# Altium schematic sheet Acquisition-System_Headphones_V1.0.SchDoc: Acquisition-System
size A4; PageSetup: Record=PageOptions|CenterHorizontal=True|CenterVertical=True|PrintScale=0.97|XCorrection=1.00|YCorrection=1.00|PrintKind=0|BorderSize=5000000|LeftOffset=0|BottomOffset=0|Orientation=2|PaperLength=1000|PaperWidth=1000|Scale=100|PaperSource=7|PrintQuality=-3|MediaType=1|DitherType=10|PrintScaleMode=1|PaperKind=A4|PaperIndex=9; Organization: Ostschweizer Fachhochschule; Address2: Florian Baumgartner & Thierry Schwaller; Address3: florian.baumgartner@ost.ch; DocumentNumber: 3; Revision: V1.0; SheetNumber: 3; SheetTotal: 5; Author: Florian Baumgartner & Alain Keller; Subtitle: Headphones Output
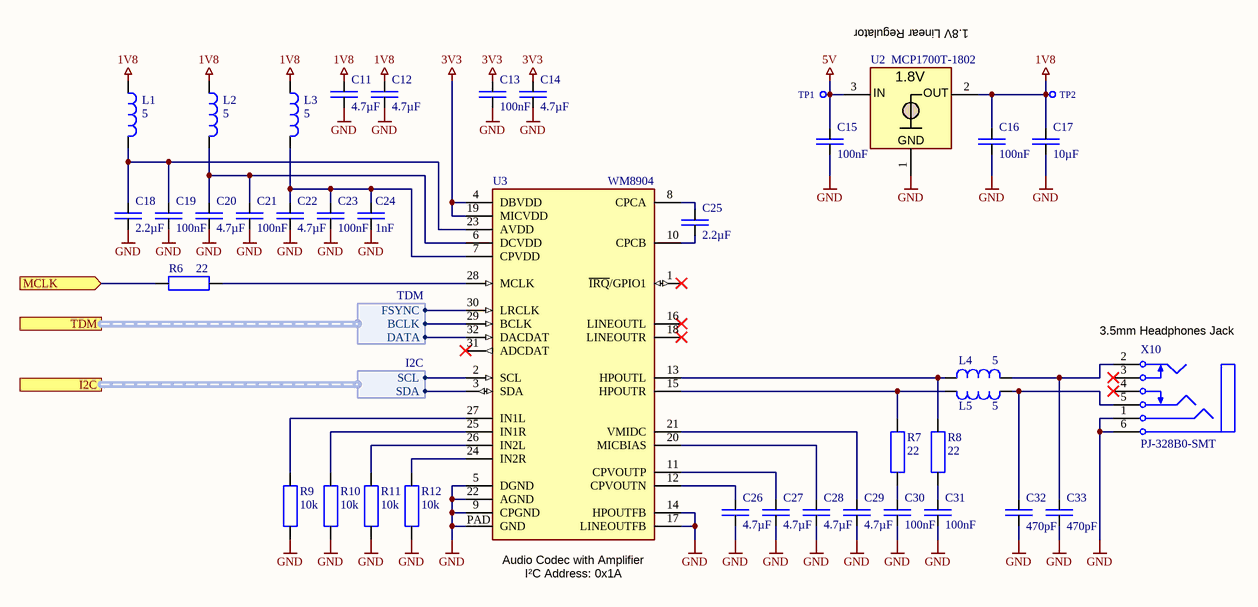
[diagram p0: Acquisition-System_Headphones_V1.0.SchDoc]

## Parts
C11  4.7µF  [SMD Keramikkondensator 0603]
C12  4.7µF  [SMD Keramikkondensator 0603]
C13  100nF  [SMD Keramikkondensator 0603]
C14  4.7µF  [SMD Keramikkondensator 0603]
C15  100nF  [SMD Keramikkondensator 0603]
C16  100nF  [SMD Keramikkondensator 0603]
C17  10µF  [SMD Keramikkondensator 1206]
C18  2.2µF  [SMD Keramikkondensator 0603]
C19  100nF  [SMD Keramikkondensator 0603]
C20  4.7µF  [SMD Keramikkondensator 0603]
C21  100nF  [SMD Keramikkondensator 0603]
C22  4.7µF  [SMD Keramikkondensator 0603]
C23  100nF  [SMD Keramikkondensator 0603]
C24  1nF  [SMD Keramikkondensator 0603]
C25  2.2µF  [SMD Keramikkondensator 0603]
C26  4.7µF  [SMD Keramikkondensator 0603]
C27  4.7µF  [SMD Keramikkondensator 0603]
C28  4.7µF  [SMD Keramikkondensator 0603]
C29  4.7µF  [SMD Keramikkondensator 0603]
C30  100nF  [SMD Keramikkondensator 0603]
C31  100nF  [SMD Keramikkondensator 0603]
C32  470pF  [SMD Keramikkondensator 0603]
C33  470pF  [SMD Keramikkondensator 0603]
L1  5  [SMD Ferritbead 0805]
L2  5  [SMD Ferritbead 0805]
L3  5  [SMD Ferritbead 0805]
L4  5  [SMD Ferritbead 0805]
L5  5  [SMD Ferritbead 0805]
R6  22  [SMD Widerstand 0603]
R7  22  [SMD Widerstand 0603]
R8  22  [SMD Widerstand 0603]
R9  10k  [SMD Widerstand 0603]
R10  10k  [SMD Widerstand 0603]
R11  10k  [SMD Widerstand 0603]
R12  10k  [SMD Widerstand 0603]
TP1  X-TP  [SMD Testpunkt Ø1mm]  (value not drawn)  (no BOM)
TP2  X-TP  [SMD Testpunkt Ø1mm]  (value not drawn)  (no BOM)
U2  MCP1700T-1802  [SMD IC SOT-23]
U3  WM8904  [SMD IC TO-263-5]
X10  PJ-328B0-SMT  [SMD 3.5mm Jack (PJ-328B0-SMT)]

## Ports
I2C (harness I2C), MCLK (in), TDM (harness TDM)

## Harnesses
I2C: SCL, SDA
TDM: BCLK, FSYNC, DATA

## Nets
1V8: C11.2 C12.2 C16.2 C17.2 L1.1 L2.1 L3.1 TP2.1 U2.2(OUT)
3V3: C13.2 C14.2 U3.4(DBVDD) U3.19(MICVDD)
5V: C15.2 TP1.1 U2.3(IN)
GND: C11.1 C12.1 C13.1 C14.1 C15.1 C16.1 C17.1 C18.1 C19.1 C20.1 C21.1 C22.1 C23.1 C24.1 C26.1 C27.1 C28.1 C29.1 C30.1 C31.1 C32.2 C33.2 R9.1 R10.1 R11.1 R12.1 U2.1(GND) U3.5(DGND) U3.9(NC) U3.14(HPOUTFB) U3.17(LINEOUTFB) U3.22(AGND) U3.PAD(GND) X10.1 X10.6
MCLK: R6.1 ; port MCLK
NetC18_2: C18.2 C19.2 L1.2 U3.23(AVDD)
NetC20_2: C20.2 C21.2 L2.2 U3.6(DCVDD)
NetC22_2: C22.2 C23.2 C24.2 L3.2 U3.7(CPVDD)
NetC25_1: C25.1 U3.10(NC)
NetC25_2: C25.2 U3.8(CPCA)
NetC26_2: C26.2 U3.12(CPVOUTN)
NetC27_2: C27.2 U3.11(NC)
NetC28_2: C28.2 U3.20(MICBIAS)
NetC29_2: C29.2 U3.21(VMIDC)
NetC30_2: C30.2 R7.2
NetC31_2: C31.2 R8.2
NetC32_1: C32.1 L5.1 X10.5
NetC33_1: C33.1 L4.1 X10.2
NetL4_2: L4.2 R8.1 U3.13(HPOUTL)
NetL5_2: L5.2 R7.1 U3.15(HPOUTR)
NetR6_2: R6.2 U3.28(MCLK)
NetR9_2: R9.2 U3.27(IN1L)
NetR10_2: R10.2 U3.25(IN1R)
NetR11_2: R11.2 U3.26(IN2L)
NetR12_2: R12.2 U3.24(IN2R)
NetU3_2: U3.2(SCL) ; port I2C.SCL
NetU3_3: U3.3(SDA) ; port I2C.SDA
NetU3_29: U3.29(BCLK) ; port TDM.BCLK
NetU3_30: U3.30(LRCLK) ; port TDM.FSYNC
NetU3_32: U3.32(DACDAT) ; port TDM.DATA

Not connected (* = marked no-connect by the designer): U3 1(~{IRQ}/GPIO1)* 16(LINEOUTL)* 18(LINEOUTR)* 31(ADCDAT)*; X10 3* 4* 9(NC) 10(NC) 11(NC)

## Notes on the sheet
- 1.8V Linear Regulator
- (near X10) 3.5mm Headphones Jack
- (near U3) Audio Codec with Amplifier
- (near U3) I²C Address: 0x1A
- Title
- Author:
- Subtitle
- Date:
- Rev:
- File:
- Sheet
- of
- (in symbol T-MCP1700T-1.8) 1.8V

## Library data of the parts
C11 C12 C14 C20 C22 C26-C29 = C-CAPACITOR: CAP-MK; Component Description: Multilayer Ceramic Capacitors; Component Value: 4.7µF 16V; Digikey: 1276-1784-1-ND; Farnell: 3013397; Mouser: 187-CL10A475KO8NNNC; JLC-Parts: C19666; Unit Price: 0.01
C13 C15 C16 C19 C21 C23 C30 C31 = E6 - 100nF: SMD Ceramic Capacitor E6; Component Value: 100nF 50V; Component Description: Multilayer Ceramic Capacitors MLCC; ComponentLink1Description: Datasheet; ComponentLink1URL: https://datasheet.lcsc.com/lcsc/1809301912_YAGEO-CC0603KRX7R9BB104_C14663.pdf; Digikey: 445-6899-1-ND; Farnell: 2210822; JLC-Parts: C14663; Mouser: 810-CGA2B3X7R1H104K; Unit Price: 0.01
C17 = E6 - 10uF: SMD Ceramic Capacitor E6; Component Value: 10µF 50V; Component Description: Multilayer Ceramic Capacitors MLCC; ComponentLink1Description: Datasheet; ComponentLink1URL: https://datasheet.lcsc.com/lcsc/1810191219_Samsung-Electro-Mechanics-CL10A106KP8NNNC_C19702.pdf; Digikey: 587-3258-1-ND; Farnell: 2113070; JLC-Parts: C13585; Mouser: 963-LMK107BBJ106MALT; Unit Price: 0.01
C18 C25 = C-CAPACITOR: CAP-MK; Component Description: Multilayer Ceramic Capacitors; Component Value: 2.2µF 16V; Digikey: 1276-1040-1-ND; Farnell: 3013392; Mouser: 187-CL10A225KO8NNNC; JLC-Parts: C23630; Unit Price: 0.01
C24 = C-CAPACITOR: CAP-MK; Component Description: Multilayer Ceramic Capacitors; Component Value: 1nF 50V; Digikey: 445-5659-1-ND; Farnell: 2435473; Mouser: 810-CGA3E2X7R1H102K; JLC-Parts: C1588; Unit Price: 0.01
C32 C33 = C-CAPACITOR: CAP-MK; Component Description: Multilayer Ceramic Capacitors; Component Value: 470pF 50V; Digikey: 399-C0603C471J5GAC7867CT-ND; Farnell: 1414640; Mouser: 80-C0603C471J5G; JLC-Parts: C107092; Unit Price: 0.01
L1-L5 = R-COIL (HF): COIL (Spule alt L); Component Description: Ferrite Bead; Component Value: GZ2012D601TF (5 Ohm@100MHz, 700mA); Farnell: 3650622; Mouser: 810-MMZ1608D050CTA00; Digikey: 445-MMZ1608D050CTA00CT-ND; ComponentLink1Description: Datasheet; ComponentLink1URL: https://datasheet.lcsc.com/lcsc/2304140030_TDK-MMZ1608D050CTA00_C307759.pdf; JLC-Parts: C307759; Unit Price: 0.01
R6-R8 = R-RESISTOR: RES (E=Heizwiderstand B=Messwandler); Component Description: Thick Film Chip Resistor; Component Value: 22 (75V, 100mW, 1%); Digikey: P22.0HCT-ND; Farnell: 2302996; Mouser: 667-ERJ-3EKF22R0V; JLC-Parts: C23345; Unit Price: 0.01
R9-R12 = R-RESISTOR: RES (E=Heizwiderstand B=Messwandler); Component Description: Thick Film Chip Resistor; Component Value: 10k (75V, 100mW, 1%); Digikey: P10.0KHCT-ND; Farnell: 2303192; Mouser: 667-ERJ-3EKF1002V; JLC-Parts: C25804; Unit Price: 0.01
TP1 TP2 = X-TP: Testpunkt; Component Value: Ø 0.8mm; Component Description: Testpunkt; Unit Price: 0.00
U2 = T-MCP1700T-1.8: Voltage Regulator; Component Description: Linear Voltage Regulator; Component Value: MCP1700T-1802E (1.8V, 200mA); Digikey: MCP1700T1802ETTCT-ND; Farnell: 1296591; Mouser: 579-MCP1700T1802E/TT; ComponentLink2Description: Datasheet; ComponentLink2URL: https://datasheet.lcsc.com/lcsc/2304140030_Microchip-Tech-MCP1700T-1802E-TT_C150796.pdf; JLC-Parts: C150796; Unit Price: 0.37
U3 = U-WM8904: Low-Power Audio Codec with Headphones Driver; Component Value: WM8904CGEFL; ComponentLink1Description: Datasheet; ComponentLink1URL: https://statics.cirrus.com/pubs/proDatasheet/WM8904_Rev4.0.pdf; Digikey: 598-2437-1-ND; JLC-Parts: C323845; Mouser: 238-WM8904CGEFL/RV; Unit Price: 1.37; Component Description: Low-Power Audio Codec with Headphones Driver
X10 = X-PJ-328B0-SMT: 3.5mm Headphone Jack 4-Pin; ComponentLink1Description: Datasheet; ComponentLink1URL: https://datasheet.lcsc.com/lcsc/2002271917_XKB-Connectivity-PJ-328B0-SMT_C437035.pdf; Digikey: CP-43514SJCT-ND; Component Value: PJ-328B0-SMT; JLC-Parts: C437035; Mouser: 490-SJ-43514-SMT-TR; Unit Price: 0.23; Component Description: 3.5mm Headphone Jack 4-Pin